# Altium schematic sheet USB.SchDoc: =GlobalProjectName
size 209 x 297 mm; ApprovedBy: Утвердил; CheckedBy: Проверил; Author: Разработал; SheetNumber: 4; SheetTotal: 9; PageSetup: Record=PageOptions|CenterHorizontal=True|CenterVertical=True|PrintScale=1.00|XCorrection=1.00|YCorrection=1.00|PrintKind=1|BorderSize=5000000|LeftOffset=0|BottomOffset=0|Orientation=2|PaperLength=1000|PaperWidth=1000|Scale=100|PaperSource=15|PrintQuality=1200|MediaType=1|DitherType=10|PaperKind=A3|PrintScaleMode=1; Weight: -; ScaleFactor: -; NormInspection: Норм.Контр.
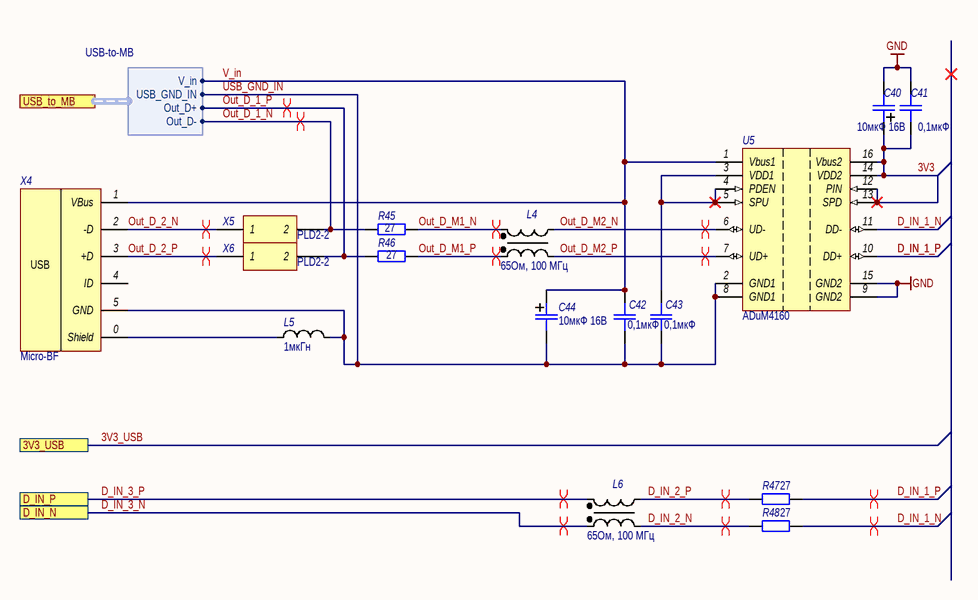
[diagram p0: USB.SchDoc]

## Parts
C40  10мкФ 16В  [SMD_size_B]
C41  0,1мкФ  [SMD_0805]
C42  0,1мкФ  [SMD_0805]
C43  0,1мкФ  [SMD_0805]
C44  10мкФ 16В  [SMD_size_B]
L4  65Ом, 100 МГц  [ACM2012]
L5  1мкГн  [SMD_0805]
L6  65Ом, 100 МГц  [ACM2012]
R45  27  [SMD_0805]
R46  27  [SMD_0805]
R47  27  [SMD_0805]
R48  27  [SMD_0805]
U5  ADuM1402  [SOIC-16-WIDE]  (value not drawn)
X4  Наименование: Micro-BF  [USB Micro-BF smd]  (hidden comment: mico-BF)
X5  Header 2X1  [PLD2-2]  (value not drawn)
X6  Header 2X1  [PLD2-2]  (value not drawn)

## Ports
3V3_USB, D_IN_N, D_IN_P, USB_to_MB (harness USB-to-MB)

## Harnesses
USB-to-MB: V_in, Out_D+, Out_D-, USB_GND_IN

## Nets
GND: C40.2 C41.1 U5.9(GND2) U5.15(GND2)
3V3: C40.1 C41.2 U5.12(PIN) U5.13(SPD) U5.14(VDD2) U5.16(Vbus2)
3V3_USB: port 3V3_USB
D_IN_1_N: R48.2 U5.11(DD-)
D_IN_1_P: R47.2 U5.10(DD+)
D_IN_2_N: L6.1 R48.1
D_IN_2_P: L6.4 R47.1
D_IN_3_N: L6.2 ; port D_IN_N
D_IN_3_P: L6.3 ; port D_IN_P
Out_D_1_N: R45.1 X5.2 ; port USB_to_MB.Out_D-
Out_D_1_P: R46.1 X6.2 ; port USB_to_MB.Out_D+
Out_D_2_N: X4.2(-D) X5.1
Out_D_2_P: X4.3(+D) X6.1
Out_D_M1_N: L4.3 R45.2
Out_D_M1_P: L4.2 R46.2
Out_D_M2_N: L4.4 U5.6(UD-)
Out_D_M2_P: L4.1 U5.7(UD+)
USB_GND_IN: C42.1 C43.1 C44.2 L5.2 U5.2(GND1) U5.8(GND1) X4.5(GND) ; port USB_to_MB.USB_GND_IN
V_in: C42.2 C44.1 U5.1(Vbus1) X4.1(VBus) ; port USB_to_MB.V_in
NetC43_2: C43.2 U5.3(VDD1) U5.4(PDEN) U5.5(SPU)
NetL5_1: L5.1 X4.0(Shield)

Not connected (* = marked no-connect by the designer): X4 4(ID)

## Layout directives
differential pair: D_IN_1_N, D_IN_1_P, D_IN_2_N, D_IN_2_P, D_IN_3_N, D_IN_3_P, Out_D_1_N, Out_D_1_P, Out_D_2_N, Out_D_2_P, Out_D_M1_N, Out_D_M1_P, Out_D_M2_N, Out_D_M2_P

## Notes on the sheet
- Подп. и дата
- Инв. № дубл.
- Взам. инв. №
- Инв. № подл.
- Изм.
- Лист
- № докум.
- Подп.
- Дата
- Форма 2а ГОСТ 2.104-2006
- Копировал
- Формат А4
- (in symbol MicroUSB) USB

## Library data of the parts
C40 C44 = Capacitor_pol: Polarized capacitor; Назначение: Поляризованный SMD-конденсатор; Наименование: Поляризованный конденсатор; Потребление, Вт: 0; Value: 10мкФх50В
C41-C43 = Capacitor: Назначение: SMD-конденсатор; Наименование: Конденсатор; Потребление, Вт: 0; Value: 0,1мкФ
L4 L6 = Inductor_coupled: Coupled inductor; Назначение: Связанная индуктивность; Value: 20мкГн, 8,5мОм; Наименование: PLT10HH1026R0PN; Потребление, Вт: 0,1
L5 = Inductor: Наименование: Индуктивность; Назначение: SMD-индуктивность; Потребление, Вт: 0,010; Value: 1мкГн
R45-R48 = Resistor: Наименование: Резистор; Назначение: SMD-резистор; Потребление, Вт: 0,001; Value: 1к
U5 = ADuM4160: Quad Channel Digital Isolator, 2.5 KV rms Insulation Rating; Назначение: цифровой изолятор шины USB; Потребление, Вт: 0,025; DataSheet: https://www.analog.com/media/en/technical-documentation/data-sheets/ADuM4160.pdf; Наименование: ADuM4160
X4 = MicroUSB: USB mico-BF; Назначение: Разъем на плату; Потребление, Вт: 0; DataSheet: *
X5 X6 = PLD2-2: Header, 2-Pin, Dual row; Потребление, Вт: 0,0; Назначение: Header, 2-Pin, Dual row; Наименование: PLD2-2